# Altium schematic sheet 11.Air_Pressure_sensor.SchDoc
size A4; SheetNumber: 12; SheetTotal: 13
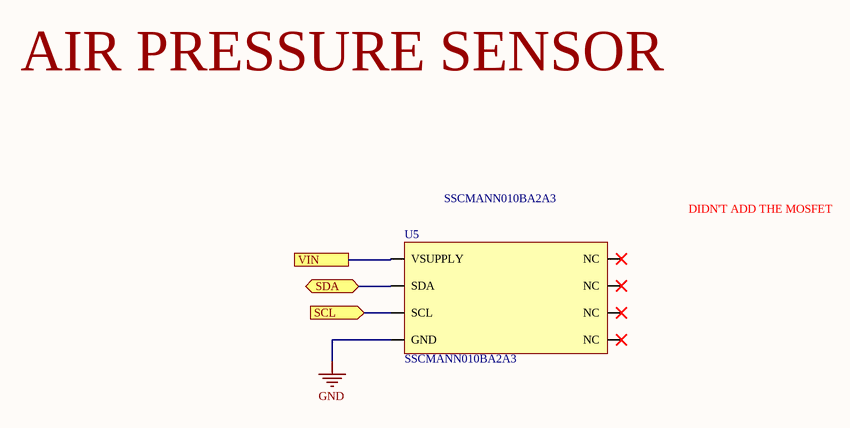
[diagram p0: 11.Air_Pressure_sensor.SchDoc]

## Parts
U5  SSCMANN010BA2A3  [SSCMANN010BA2A3]

## Ports
SCL (in), SDA (bidir), VIN

## Nets
GND: U5.1(GND)
SCL: U5.4(SCL) ; port SCL
SDA: U5.3(SDA) ; port SDA
VIN: U5.2(VSUPPLY) ; port VIN

Not connected (* = marked no-connect by the designer): U5 5(NC)* 6(NC)* 7(NC)* 8(NC)*

## Notes on the sheet
- AIR PRESSURE SENSOR
- (near U5) SSCMANN010BA2A3
- DIDN'T ADD THE MOSFET

## Library data of the parts
U5 = SSCMANN010BA2A3: MFR: HONEYWELL; D: Board Mount Pressure Sensors; PN: SSCMANN010BA2A3; URL: https://www.mouser.in/ProductDetail/Honeywell/SSCMANN010BA2A3?qs=V2VaM7qhK8cLhmuNijeOKA%3D%3D